# EAGLE design PQ60-Template (EAGLE 7.2.0)
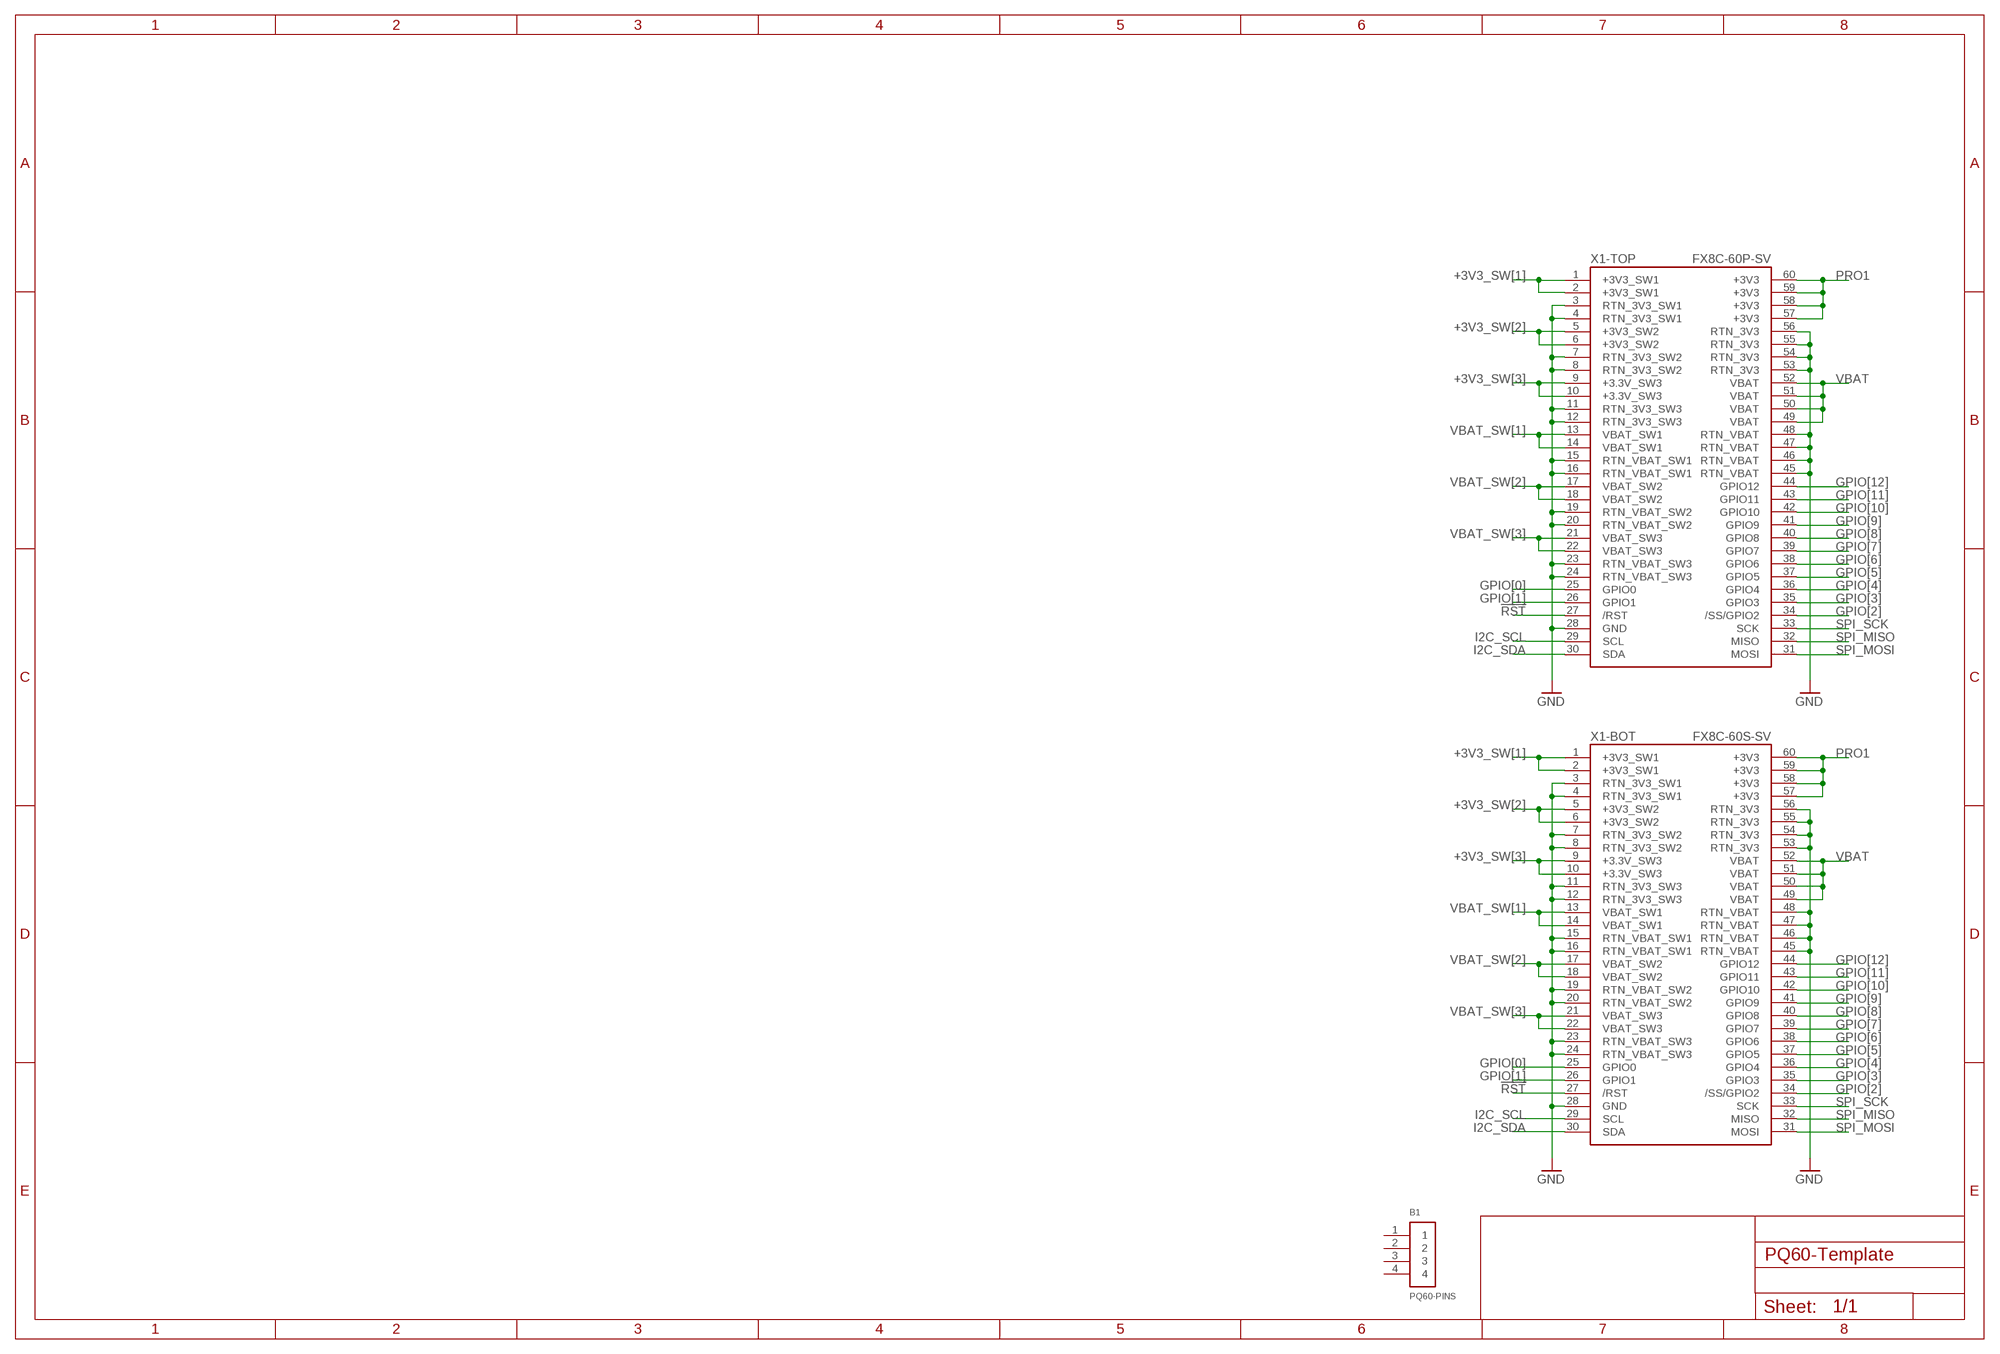
[diagram p0: schematic, sheet 1]

## Parts
B1  PQ60-PINS  [PQ60_PINS]
X1-BOT  FX8C-60S-SV  FX8C-60-R2S-SV  [FX8C-60S-SV]
X1-TOP  FX8C-60P-SV  FX8C-60-R2P-SV  [FX8C-60P-SV]

## Nets
!RST: X1-BOT.27(/RST) X1-TOP.27(/RST)
+3V3_SW[1]: X1-BOT.1(+3V3_SW1) X1-BOT.2(+3V3_SW1) X1-TOP.1(+3V3_SW1) X1-TOP.2(+3V3_SW1)
+3V3_SW[2]: X1-BOT.5(+3V3_SW2) X1-BOT.6(+3V3_SW2) X1-TOP.5(+3V3_SW2) X1-TOP.6(+3V3_SW2)
+3V3_SW[3]: X1-BOT.9(+3.3V_SW3) X1-BOT.10(+3.3V_SW3) X1-TOP.9(+3.3V_SW3) X1-TOP.10(+3.3V_SW3)
GND: X1-BOT.3(RTN_3V3_SW1) X1-BOT.4(RTN_3V3_SW1) X1-BOT.7(RTN_3V3_SW2) X1-BOT.8(RTN_3V3_SW2) X1-BOT.11(RTN_3V3_SW3) X1-BOT.12(RTN_3V3_SW3) X1-BOT.15(RTN_VBAT_SW1) X1-BOT.16(RTN_VBAT_SW1) X1-BOT.19(RTN_VBAT_SW2) X1-BOT.20(RTN_VBAT_SW2) X1-BOT.23(RTN_VBAT_SW3) X1-BOT.24(RTN_VBAT_SW3) X1-BOT.28(GND) X1-BOT.45(RTN_VBAT) X1-BOT.46(RTN_VBAT) X1-BOT.47(RTN_VBAT) X1-BOT.48(RTN_VBAT) X1-BOT.53(RTN_3V3) X1-BOT.54(RTN_3V3) X1-BOT.55(RTN_3V3) X1-BOT.56(RTN_3V3) X1-TOP.3(RTN_3V3_SW1) X1-TOP.4(RTN_3V3_SW1) X1-TOP.7(RTN_3V3_SW2) X1-TOP.8(RTN_3V3_SW2) X1-TOP.11(RTN_3V3_SW3) X1-TOP.12(RTN_3V3_SW3) X1-TOP.15(RTN_VBAT_SW1) X1-TOP.16(RTN_VBAT_SW1) X1-TOP.19(RTN_VBAT_SW2) X1-TOP.20(RTN_VBAT_SW2) X1-TOP.23(RTN_VBAT_SW3) X1-TOP.24(RTN_VBAT_SW3) X1-TOP.28(GND) X1-TOP.45(RTN_VBAT) X1-TOP.46(RTN_VBAT) X1-TOP.47(RTN_VBAT) X1-TOP.48(RTN_VBAT) X1-TOP.53(RTN_3V3) X1-TOP.54(RTN_3V3) X1-TOP.55(RTN_3V3) X1-TOP.56(RTN_3V3)
GPIO[0]: X1-BOT.25(GPIO0) X1-TOP.25(GPIO0)
GPIO[1]: X1-BOT.26(GPIO1) X1-TOP.26(GPIO1)
GPIO[2]: X1-BOT.34(/SS/GPIO2) X1-TOP.34(/SS/GPIO2)
GPIO[3]: X1-BOT.35(GPIO3) X1-TOP.35(GPIO3)
GPIO[4]: X1-BOT.36(GPIO4) X1-TOP.36(GPIO4)
GPIO[5]: X1-BOT.37(GPIO5) X1-TOP.37(GPIO5)
GPIO[6]: X1-BOT.38(GPIO6) X1-TOP.38(GPIO6)
GPIO[7]: X1-BOT.39(GPIO7) X1-TOP.39(GPIO7)
GPIO[8]: X1-BOT.40(GPIO8) X1-TOP.40(GPIO8)
GPIO[9]: X1-BOT.41(GPIO9) X1-TOP.41(GPIO9)
GPIO[10]: X1-BOT.42(GPIO10) X1-TOP.42(GPIO10)
GPIO[11]: X1-BOT.43(GPIO11) X1-TOP.43(GPIO11)
GPIO[12]: X1-BOT.44(GPIO12) X1-TOP.44(GPIO12)
I2C_SCL: X1-BOT.29(SCL) X1-TOP.29(SCL)
I2C_SDA: X1-BOT.30(SDA) X1-TOP.30(SDA)
PRO1: X1-BOT.57(+3V3) X1-BOT.58(+3V3) X1-BOT.59(+3V3) X1-BOT.60(+3V3) X1-TOP.57(+3V3) X1-TOP.58(+3V3) X1-TOP.59(+3V3) X1-TOP.60(+3V3)
SPI_MISO: X1-BOT.32(MISO) X1-TOP.32(MISO)
SPI_MOSI: X1-BOT.31(MOSI) X1-TOP.31(MOSI)
SPI_SCK: X1-BOT.33(SCK) X1-TOP.33(SCK)
VBAT: X1-BOT.49(VBAT) X1-BOT.50(VBAT) X1-BOT.51(VBAT) X1-BOT.52(VBAT) X1-TOP.49(VBAT) X1-TOP.50(VBAT) X1-TOP.51(VBAT) X1-TOP.52(VBAT)
VBAT_SW[1]: X1-BOT.13(VBAT_SW1) X1-BOT.14(VBAT_SW1) X1-TOP.13(VBAT_SW1) X1-TOP.14(VBAT_SW1)
VBAT_SW[2]: X1-BOT.17(VBAT_SW2) X1-BOT.18(VBAT_SW2) X1-TOP.17(VBAT_SW2) X1-TOP.18(VBAT_SW2)
VBAT_SW[3]: X1-BOT.21(VBAT_SW3) X1-BOT.22(VBAT_SW3) X1-TOP.21(VBAT_SW3) X1-TOP.22(VBAT_SW3)
Unconnected: B1.1 B1.2 B1.3 B1.4

## Library data of the parts
B1 = general:PQ60-PINS; OC_FARNELL: unknown
X1-BOT X1-TOP = PQ60:FX8C-60-R2; OC_FARNELL: unknown

## Board
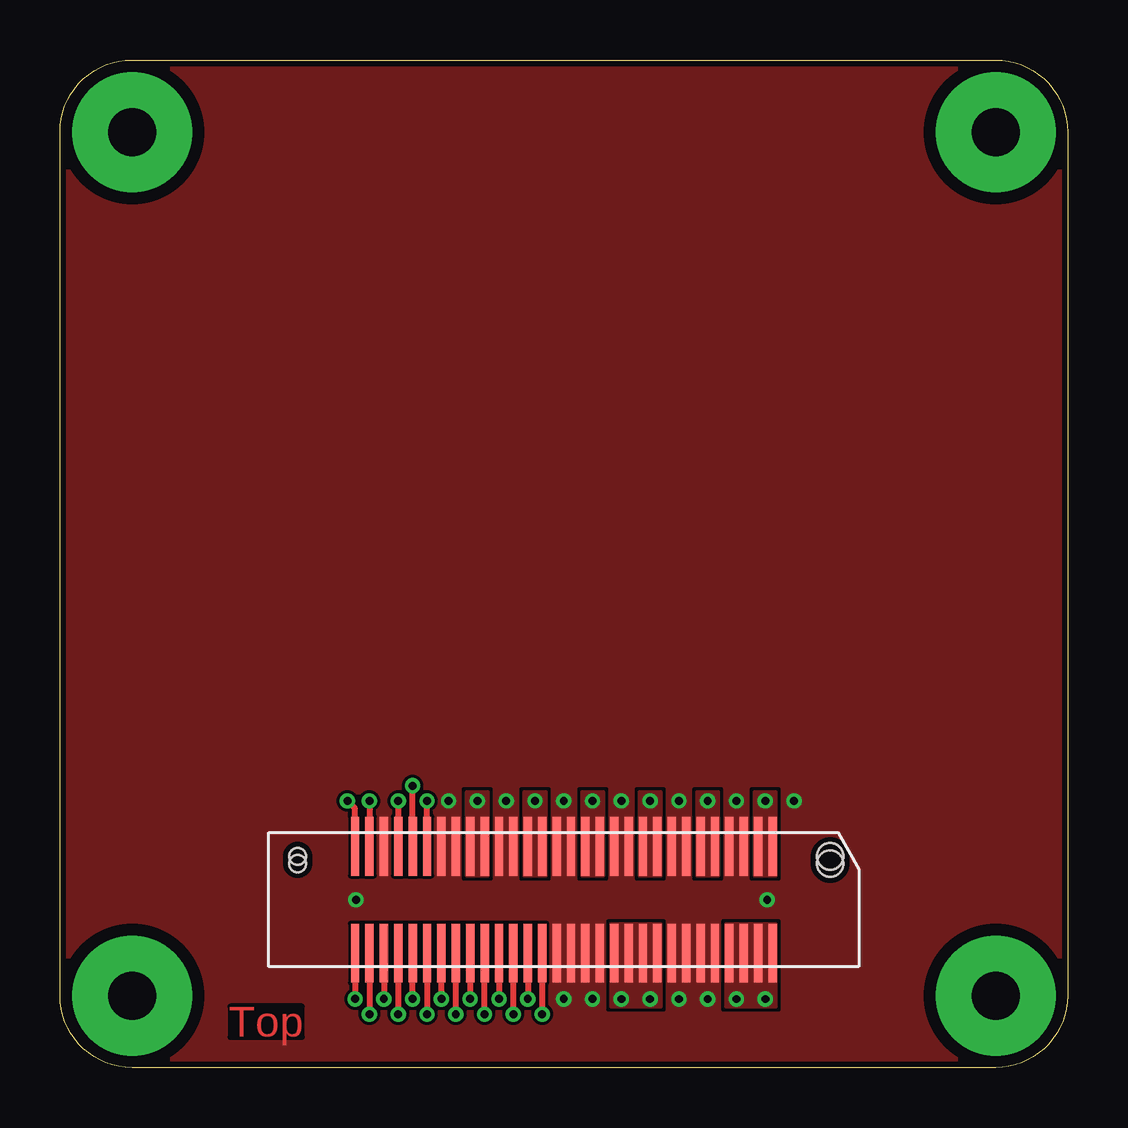
[diagram p1: board, top side]
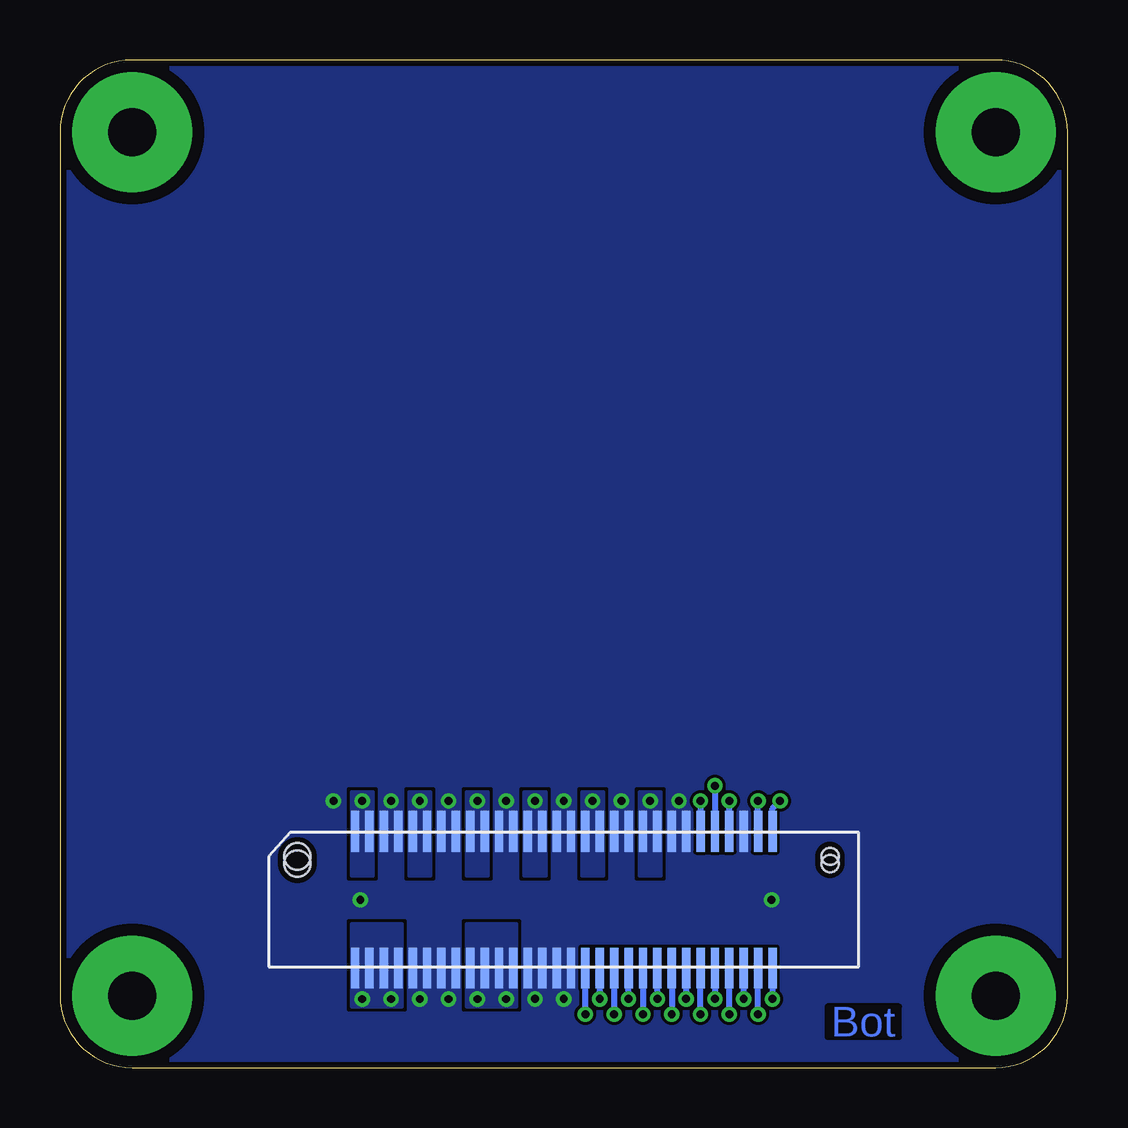
[diagram p2: board, bottom side, seen from below]

Size 42 x 42 mm. Coordinates in mm from the lower left corner, seen from the top.
Copper layers (1*16): Top 0.035mm / dielectric 1.5mm / Bottom 0.035mm
Design rules "dirt_cheap_dirty_boards.v1": minimum track width 5mil, minimum drill 12mil, track to track 5mil, track to pad 5mil, pad to pad 5mil, via to via 5mil, smd to smd 0mil, copper to edge 10mil, drill to drill 10mil, minimum pad ring 10mil, minimum via ring 6mil, stop-mask expansion 2mil, vias tented up to drill 25mil, thermal gap 10mil

### Footprints (pad centres in the part's own frame; a part is rotated, then mirrored left to right if it is on the bottom)
PQ60_PINS = drill 2 pad 5: 1 3,3; 2 3,39; 3 39,39; 4 39,3
FX8C-60S-SV = smd 0.35 x 1.7: 1 -8.7,2.85; 2 -8.1,2.85; 3 -7.5,2.85; 4 -6.9,2.85; 5 -6.3,2.85; 6 -5.7,2.85; 7 -5.1,2.85; 8 -4.5,2.85; 9 -3.9,2.85; 10 -3.3,2.85; 11 -2.7,2.85; 12 -2.1,2.85; 13 -1.5,2.85; 14 -0.9,2.85; 15 -0.3,2.85; 16 0.3,2.85; 17 0.9,2.85; 18 1.5,2.85; 19 2.1,2.85; 20 2.7,2.85; 21 3.3,2.85; 22 3.9,2.85; 23 4.5,2.85; 24 5.1,2.85; 25 5.7,2.85; 26 6.3,2.85; 27 6.9,2.85; 28 7.5,2.85; 29 8.1,2.85; 30 8.7,2.85; 31 8.7,-2.85; 32 8.1,-2.85; 33 7.5,-2.85; 34 6.9,-2.85; 35 6.3,-2.85; 36 5.7,-2.85; 37 5.1,-2.85; 38 4.5,-2.85; 39 3.9,-2.85; 40 3.3,-2.85; 41 2.7,-2.85; 42 2.1,-2.85; 43 1.5,-2.85; 44 0.9,-2.85; 45 0.3,-2.85; 46 -0.3,-2.85; 47 -0.9,-2.85; 48 -1.5,-2.85; 49 -2.1,-2.85; 50 -2.7,-2.85; 51 -3.3,-2.85; 52 -3.9,-2.85; 53 -4.5,-2.85; 54 -5.1,-2.85; 55 -5.7,-2.85; 56 -6.3,-2.85; 57 -6.9,-2.85; 58 -7.5,-2.85; 59 -8.1,-2.85; 60 -8.7,-2.85 | hole 1.1: -11.1,1.8 | hole 0.7: 11.1,1.8
FX8C-60P-SV = smd 0.35 x 2.45: 1 -8.7,-2.225; 2 -8.1,-2.225; 3 -7.5,-2.225; 4 -6.9,-2.225; 5 -6.3,-2.225; 6 -5.7,-2.225; 7 -5.1,-2.225; 8 -4.5,-2.225; 9 -3.9,-2.225; 10 -3.3,-2.225; 11 -2.7,-2.225; 12 -2.1,-2.225; 13 -1.5,-2.225; 14 -0.9,-2.225; 15 -0.3,-2.225; 16 0.3,-2.225; 17 0.9,-2.225; 18 1.5,-2.225; 19 2.1,-2.225; 20 2.7,-2.225; 21 3.3,-2.225; 22 3.9,-2.225; 23 4.5,-2.225; 24 5.1,-2.225; 25 5.7,-2.225; 26 6.3,-2.225; 27 6.9,-2.225; 28 7.5,-2.225; 29 8.1,-2.225; 30 8.7,-2.225; 31 8.7,2.225; 32 8.1,2.225; 33 7.5,2.225; 34 6.9,2.225; 35 6.3,2.225; 36 5.7,2.225; 37 5.1,2.225; 38 4.5,2.225; 39 3.9,2.225; 40 3.3,2.225; 41 2.7,2.225; 42 2.1,2.225; 43 1.5,2.225; 44 0.9,2.225; 45 0.3,2.225; 46 -0.3,2.225; 47 -0.9,2.225; 48 -1.5,2.225; 49 -2.1,2.225; 50 -2.7,2.225; 51 -3.3,2.225; 52 -3.9,2.225; 53 -4.5,2.225; 54 -5.1,2.225; 55 -5.7,2.225; 56 -6.3,2.225; 57 -6.9,2.225; 58 -7.5,2.225; 59 -8.1,2.225; 60 -8.7,2.225 | hole 1.1: -11.1,-1.5 | hole 0.7: 11.1,-1.5

### Placement (x,y rotation side)
B1  0,0 0 top
X1-BOT  21,7 0 bottom
X1-TOP  21,7 180 top

### Tracks (layer width: path | path; a pad name or v marks a point on that pad's centre or on a via)
!RST  (via drill 0.33)
  Top 0.254: v14.1,11.11 X1-TOP.27
  Bottom 0.254: X1-BOT.27 v14.1,11.11
+3V3_SW[1]  (via drill 0.33)
  other vias: 29.4,11.11
  pour Top (no thermals): 28.95,11.5 29.85,11.5 29.85,8 28.95,8
  pour Bottom (no thermals): 28.95,11.5 29.85,11.5 29.85,8 28.95,8
+3V3_SW[2]  (via drill 0.33)
  other vias: 27,11.11
  pour Top (no thermals): 26.55,11.5 27.45,11.5 27.45,8 26.55,8
  pour Bottom (no thermals): 26.55,11.5 27.45,11.5 27.45,8 26.55,8
+3V3_SW[3]  (via drill 0.33)
  other vias: 24.6,11.11
  pour Top (no thermals): 24.15,11.5 25.05,11.5 25.05,8 24.15,8
  pour Bottom (no thermals): 24.15,11.5 25.05,11.5 25.05,8 24.15,8
GND  (via drill 0.33)
  other vias: 12.34,6.99 29.48,6.99 27,2.85 25.8,2.85 22.2,2.86 21,2.86 18.6,11.11 21,11.11 23.4,11.11 25.8,11.11 28.2,11.11 16.2,11.11 30.6,11.11
  pour Top (rank 6): 42,42 0,42 0,0 42,0
  pour Bottom (rank 6): 42,42 0,42 0,0 42,0
  pour Bottom (rank 4, no thermals): 10.75,11.75 30.75,11.75 30.75,0.95 10.75,0.95
  pour Top (rank 4, no thermals): 10.75,11.43 30.75,11.43 30.75,0.95 10.75,0.95
GPIO[0]  (via drill 0.33)
  Top 0.254: X1-TOP.25 v15.3,11.11
  Bottom 0.254: v15.3,11.11 X1-BOT.25
GPIO[1]  (via drill 0.33)
  Top 0.254: X1-TOP.26 v14.7,11.75
  Bottom 0.254: v14.7,11.75 X1-BOT.26
GPIO[2]  (via drill 0.33)
  Top 0.254: X1-TOP.34 v14.1,2.22
  Bottom 0.254: v14.1,2.22 X1-BOT.34
GPIO[3]  (via drill 0.33)
  Top 0.254: v14.7,2.86 X1-TOP.35
  Bottom 0.254: X1-BOT.35 v14.7,2.86
GPIO[4]  (via drill 0.33)
  Top 0.254: X1-TOP.36 v15.3,2.22
  Bottom 0.254: v15.3,2.22 X1-BOT.36
GPIO[5]  (via drill 0.33)
  Top 0.254: v15.9,2.86 X1-TOP.37
  Bottom 0.254: X1-BOT.37 v15.9,2.86
GPIO[6]  (via drill 0.33)
  Top 0.254: v16.5,2.22 X1-TOP.38
  Bottom 0.254: X1-BOT.38 v16.5,2.22
GPIO[7]  (via drill 0.33)
  Top 0.254: X1-TOP.39 v17.1,2.86 arc-90 v17.1,2.86
  Bottom 0.254: v17.1,2.86 X1-BOT.39 arc-90 X1-BOT.39
GPIO[8]  (via drill 0.33)
  Top 0.254: v17.7,2.22 X1-TOP.40
  Bottom 0.254: X1-BOT.40 v17.7,2.22
GPIO[9]  (via drill 0.33)
  Top 0.254: X1-TOP.41 v18.3,2.86
  Bottom 0.254: v18.3,2.86 X1-BOT.41
GPIO[10]  (via drill 0.33)
  Top 0.254: v18.9,2.22 X1-TOP.42
  Bottom 0.254: X1-BOT.42 v18.9,2.22
GPIO[11]  (via drill 0.33)
  Top 0.254: X1-TOP.43 v19.5,2.86
  Bottom 0.254: v19.5,2.86 X1-BOT.43
GPIO[12]  (via drill 0.33)
  Top 0.254: X1-TOP.44 v20.1,2.22
  Bottom 0.254: v20.1,2.22 X1-BOT.44
I2C_SCL  (via drill 0.33)
  Top 0.254: v12.9,11.11 X1-TOP.29
  Bottom 0.254: X1-BOT.29 v12.9,11.11
I2C_SDA  (via drill 0.33)
  Top 0.254: X1-TOP.30 12.3,10.79 v11.98,11.11
  Bottom 0.254: X1-BOT.30 12.3,10.79 v11.98,11.11
PRO1  (via drill 0.33)
  Top 0.406: v29.4,2.86 v29.4,2.85
  other vias: 28.2,2.85
  pour Top (no thermals): 27.75,6 29.85,6 29.85,2.54 27.75,2.54
  pour Bottom (no thermals): 27.75,6 29.85,6 29.85,2.54 27.75,2.54
SPI_MISO  (via drill 0.33)
  Top 0.254: X1-TOP.32 v12.9,2.22
  Bottom 0.254: v12.9,2.22 X1-BOT.32
SPI_MOSI  (via drill 0.33)
  Top 0.254: X1-TOP.31 v12.3,2.86
  Bottom 0.254: X1-BOT.31 v12.3,2.86
SPI_SCK  (via drill 0.33)
  Top 0.254: X1-TOP.33 v13.5,2.86
  Bottom 0.254: v13.5,2.86 X1-BOT.33
VBAT  (via drill 0.33)
  other vias: 23.4,2.85 24.6,2.85
  pour Bottom (no thermals): 22.96,6 25.05,6 25.05,2.54 22.96,2.54
  pour Top (no thermals): 22.96,6 25.05,6 25.05,2.54 22.96,2.54
VBAT_SW[1]  (via drill 0.33)
  other vias: 22.2,11.11
  pour Top (no thermals): 21.75,11.5 22.65,11.5 22.65,8 21.75,8
  pour Bottom (no thermals): 21.75,11.5 22.65,11.5 22.65,8 21.75,8
VBAT_SW[2]  (via drill 0.33)
  other vias: 19.8,11.11
  pour Bottom (no thermals): 19.35,11.5 20.25,11.5 20.25,8 19.35,8
  pour Top (no thermals): 19.35,11.5 20.25,11.5 20.25,8 19.35,8
VBAT_SW[3]  (via drill 0.33)
  other vias: 17.4,11.11
  pour Top (no thermals): 16.95,11.5 17.85,11.5 17.85,8 16.95,8
  pour Bottom (no thermals): 16.95,11.5 17.85,11.5 17.85,8 16.95,8

### Text on the board
Top: Top
Bottom: Bot